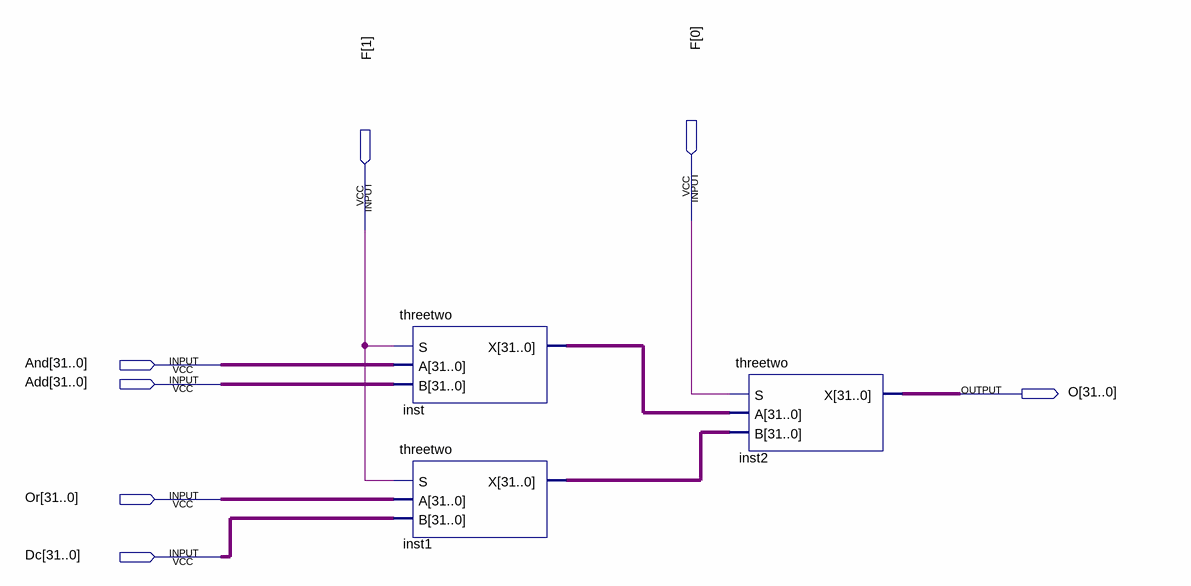
[diagram p0: schematic sheet]
// Quartus schematic bitmulti.bdf as structural Verilog: 3 symbols, 7 pins
module bitmulti (
  input  [1:0] F,
  input  [31:0] And,
  input  [31:0] Add,
  input  [31:0] Or,
  input  [31:0] Dc,
  output [31:0] O
);

  wire [31:0] inst1_x, inst_x;

  threetwo inst (.S(F[1]), .A(And), .B(Add), .X(inst_x));
  threetwo inst1 (.S(F[1]), .A(Or), .B(Dc), .X(inst1_x));
  threetwo inst2 (.S(F[0]), .A(inst_x), .B(inst1_x), .X(O));
endmodule
